# EAGLE design microzed_sd_v0.4 (EAGLE 6.5.4)
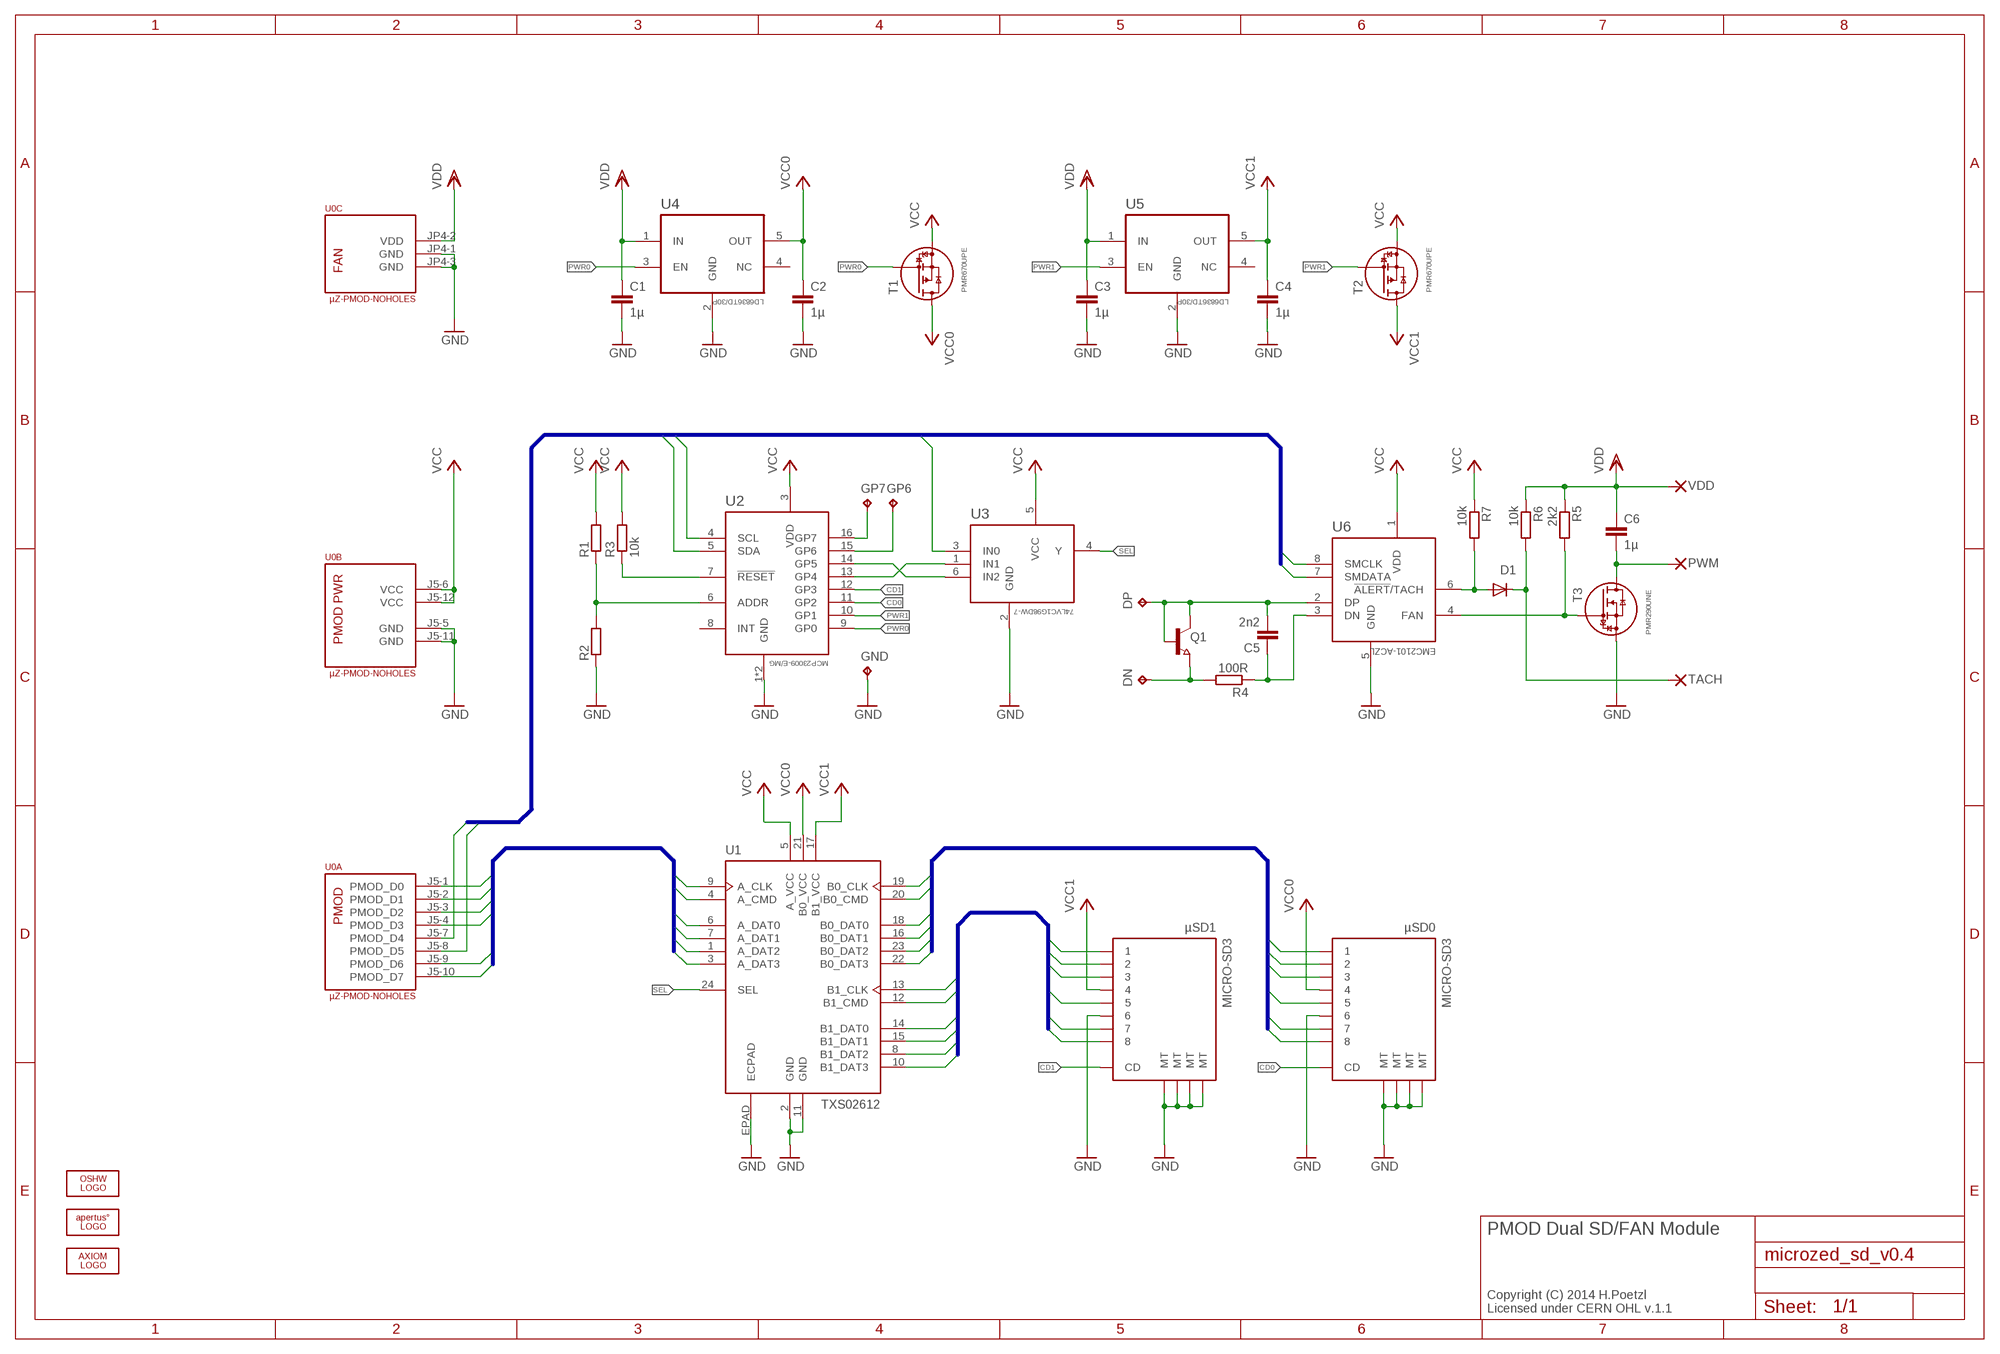
[diagram p0: schematic, sheet 1]

## Parts
C1  1µ  C-EUC0402K  [C0402K]
C2  1µ  C-EUC0402K  [C0402K]
C3  1µ  C-EUC0402K  [C0402K]
C4  1µ  C-EUC0402K  [C0402K]
C5  2n2  C-EUC0402K  [C0402K]
C6  1µ  C-EUC0402K  [C0402K]
D1  DIODE-MICROMELF-W  [MICROMELF-W]
DN  TPTP20R  [TP20R]
DP  TPTP20R  [TP20R]
GND  TPTP20R  [TP20R]
GP6  TPTP20R  [TP20R]
GP7  TPTP20R  [TP20R]
LOGO1  OSHW_LOGO_FILLX0100-NT  [OSHW_FILLX100_NOTEXT]
PWM  WIREPAD2,15/1,0  [2,15/1,0]
Q1  NPN-TRANSISTOR_SOT23  [SOT23]
R1  R-EU_R0603  [R0603]
R2  R-EU_R0603  [R0603]
R3  10k  R-EU_R0603  [R0603]
R4  100R  R-EU_R0402  [R0402]
R5  2k2  R-EU_R0402  [R0402]
R6  10k  R-EU_R0402  [R0402]
R7  10k  R-EU_R0402  [R0402]
T1  PMR670UPE  [SOT416]
T2  PMR670UPE  [SOT416]
T3  PMR290UNE  [SOT416]
TACH  WIREPAD2,15/1,0  [2,15/1,0]
U0  µZ-PMOD-NOHOLES  [µZ-TOP-NOHOLES]
U1  TXS02612  [S-PWQFN-N24]
U2  MCP23009-E/MG  [QFN50P300X300X80-17N]
U3  74LVC1G98DW-7  [SOT65P210X110-6N]
U4  LD6836TD/30P  [SOT95P275X110-5N]
U5  LD6836TD/30P  [SOT95P275X110-5N]
U6  EMC2101-ACZL  [SOP65P490X110-8N]
U$1  APERTUS_LOGO334X100  [APERTUS_LOGO_334X100]
U$13  AXIOM_LOGO525X80  [AXIOM_LOGO_525X80]
VDD  WIREPAD2,15/1,0  [2,15/1,0]
µSD0  MICRO-SD3  [TF-MICRO-SD_PP3]
µSD1  MICRO-SD3  [TF-MICRO-SD_PP3]

## Nets
A_CLK: U0.J5-4(A:PMOD_D3) U1.9(A_CLK)
A_CMD: U0.J5-3(A:PMOD_D2) U1.4(A_CMD)
A_DAT0: U0.J5-2(A:PMOD_D1) U1.6(A_DAT0)
A_DAT1: U0.J5-1(A:PMOD_D0) U1.7(A_DAT1)
A_DAT2: U0.J5-9(A:PMOD_D6) U1.1(A_DAT2)
A_DAT3: U0.J5-10(A:PMOD_D7) U1.3(A_DAT3)
B0_CLK: U1.19(B0_CLK) µSD0.5
B0_CMD: U1.20(B0_CMD) µSD0.3
B0_DAT0: U1.18(B0_DAT0) µSD0.7
B0_DAT1: U1.16(B0_DAT1) µSD0.8
B0_DAT2: U1.23(B0_DAT2) µSD0.1
B0_DAT3: U1.22(B0_DAT3) µSD0.2
B1_CLK: U1.13(B1_CLK) µSD1.5
B1_CMD: U1.12(B1_CMD) µSD1.3
B1_DAT0: U1.14(B1_DAT0) µSD1.7
B1_DAT1: U1.15(B1_DAT1) µSD1.8
B1_DAT2: U1.8(B1_DAT2) µSD1.1
B1_DAT3: U1.10(B1_DAT3) µSD1.2
CD0: U2.11(GP2) µSD0.CD
CD1: U2.12(GP3) µSD1.CD
DN: DN.TP Q1.2(E) R4.2
DP: C5.2 DP.TP Q1.1(B) Q1.3(C) U6.2(DP)
FAN: C6.2 PWM.1(P) T3.3(D)
GND: C1.2 C2.2 C3.2 C4.2 GND.TP R2.1 T3.2(S) U0.J5-5(B:GND) U0.J5-11(B:GND) U0.JP4-1(C:GND) U0.JP4-3(C:GND) U1.2(GND) U1.11(GND) U1.EPAD(ECPAD) U2.1(GND) U2.17(GND) U3.2(GND) U4.2(GND) U5.2(GND) U6.5(GND) µSD0.6 µSD0.MT1(MT) µSD0.MT2(MT) µSD0.MT3(MT) µSD0.MT4(MT) µSD1.6 µSD1.MT1(MT) µSD1.MT2(MT) µSD1.MT3(MT) µSD1.MT4(MT)
GP6: GP6.TP U2.15(GP6)
GP7: GP7.TP U2.16(GP7)
N$1: U2.13(GP4) U3.1(IN1)
N$2: U2.14(GP5) U3.6(IN2)
N$3: R1.1 R2.2 U2.6(ADDR)
N$4: R3.1 U2.7(!RESET)
N$8: C5.1 R4.1 U6.3(DN)
N$12: R5.2 T3.1(G) U6.4(FAN)
N$13: D1.A R7.2 U6.6(!ALERT!/TACH)
PWR0: T1.1(G) U2.9(GP0) U4.3(EN)
PWR1: T2.1(G) U2.10(GP1) U5.3(EN)
SCL: U0.J5-7(A:PMOD_D4) U2.4(SCL) U6.8(SMCLK)
SDA: U0.J5-8(A:PMOD_D5) U2.5(SDA) U3.3(IN0) U6.7(SMDATA)
SEL: U1.24(SEL) U3.4(Y)
TACH: D1.C R6.2 TACH.1(P)
VCC: R1.2 R3.2 R7.1 T1.2(S) T2.2(S) U0.J5-6(B:VCC) U0.J5-12(B:VCC) U1.5(A_VCC) U2.3(VDD) U3.5(VCC) U6.1(VDD)
VCC0: C2.1 T1.3(D) U1.21(B0_VCC) U4.5(OUT) µSD0.4
VCC1: C4.1 T2.3(D) U1.17(B1_VCC) U5.5(OUT) µSD1.4
VDD: C1.1 C3.1 C6.1 R5.1 R6.1 U0.JP4-2(C:VDD) U4.1(IN) U5.1(IN) VDD.1(P)
Unconnected: U2.8(INT) U4.4(NC) U5.4(NC)

## Buses
B0_CLK,B0_CMD,B0_DAT[0..3]
B1_CLK,B1_CMD,B1_DAT[0..3]
A_CLK,A_CMD,A_DAT[0..3],SEL,CD
SCL,SDA

## Notes on the sheet
- PMOD Dual SD/FAN Module
- Copyright (C) 2014 H.Poetzl
  Licensed under CERN OHL v.1.1

## Library data of the parts
C1-C6 = rcl:C-EU: CAPACITOR, European symbol
D1 = diode:DIODE-: DIODE
DN DP GND GP6 GP7 = testpad:TP: Test pad
LOGO1 = ohw-logo:OSHW_LOGO_FILL
PWM TACH VDD = wirepad:WIREPAD: Wire PAD connect wire on PCB
Q1 = semicon-smd-ipc:NPN-TRANSISTOR_: NPN TRANSISTOR
R1-R7 = rcl:R-EU_: RESISTOR, European symbol
T1 T2 = transistor:PMR670UPE: 20 V, 480 mA P-channel Trench MOSFET Herbert Poetzl
T3 = transistor:PMR290UNE: 20 V, 700 mA N-channel Trench MOSFET Herbert Poetzl
U0 = microzed:µZ-PMOD
U1 = TXS02612:TXS02612
U2 = mcp23009:MCP23009: IC, I/O EXPANDER, 8BIT, 3.4MHZ,
U3 = 74lvc1g98:74LVC1G98: CONFIGURABLE MULTIPLE-FUNCTION GATE; MPN: 74LVC1G98DW-7; OC_FARNELL: 1893843; OC_NEWARK: 47T3929; PACKAGE: SOT-6; SUPPLIER: DIODES INC.
U4 U5 = ld6836:LD6836TD/30P: LDO, 5.5V, 0.09VDO, 0.3A, 3V, 5SOT753; MPN: LD6836TD/30P; OC_FARNELL: 2308335; OC_NEWARK: 69W9605; PACKAGE: TSOP-5; SUPPLIER: NXP
U6 = emc2101:EMC2101: SMBUS FAN CONTROL WITH ACCURATE TEMPERATURE MONITORING ,MSOP-8; MPN: EMC2101-ACZL-TR; OC_FARNELL: 2361961; OC_NEWARK: 12X8574; PACKAGE: MSOP-8; SUPPLIER: MICROCHIP
U$1 = logos_apertus_axiom:APERTUS_LOGO
U$13 = logos_apertus_axiom:AXIOM_LOGO
µSD0 µSD1 = micro-sd:MICRO-SD

## Net classes
1 LVDS: width 0.305 mm, drill 0.305 mm, clearance 0.152 mm

## Board
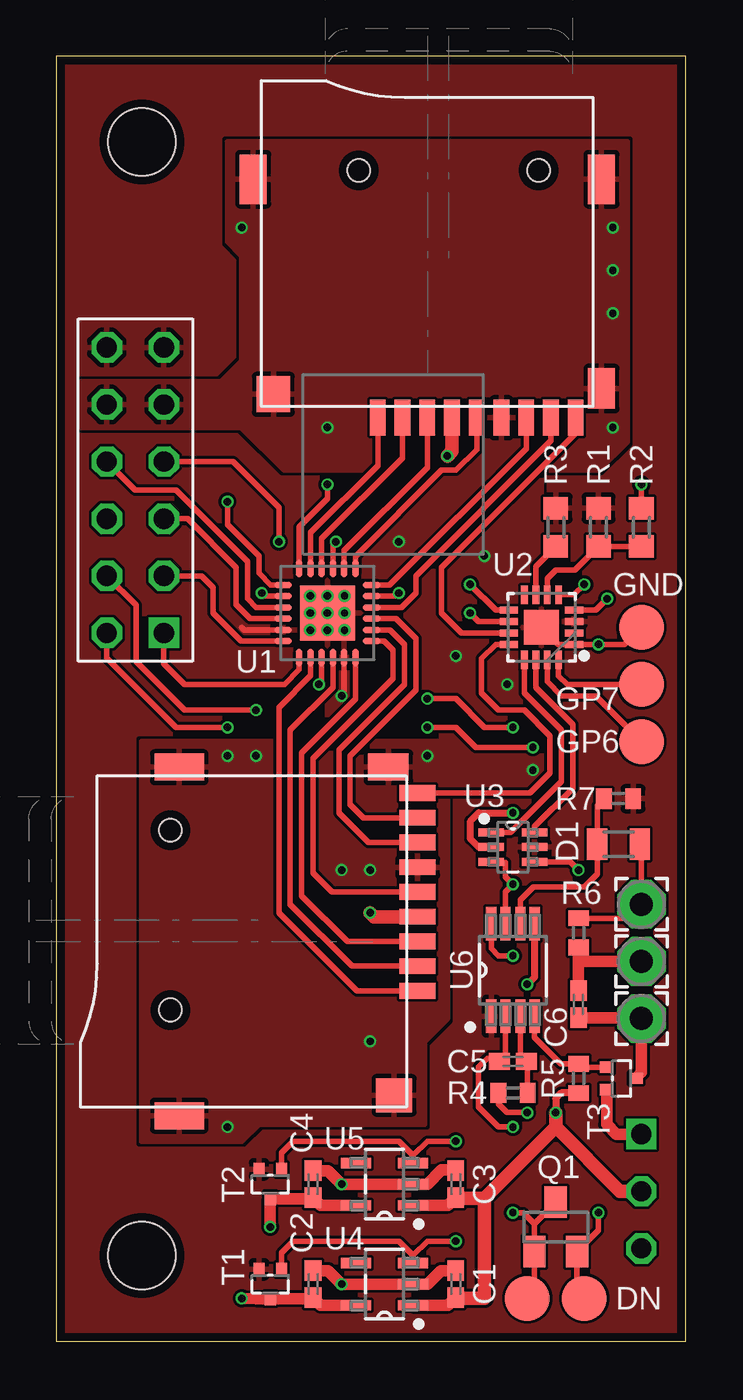
[diagram p1: board, top side]
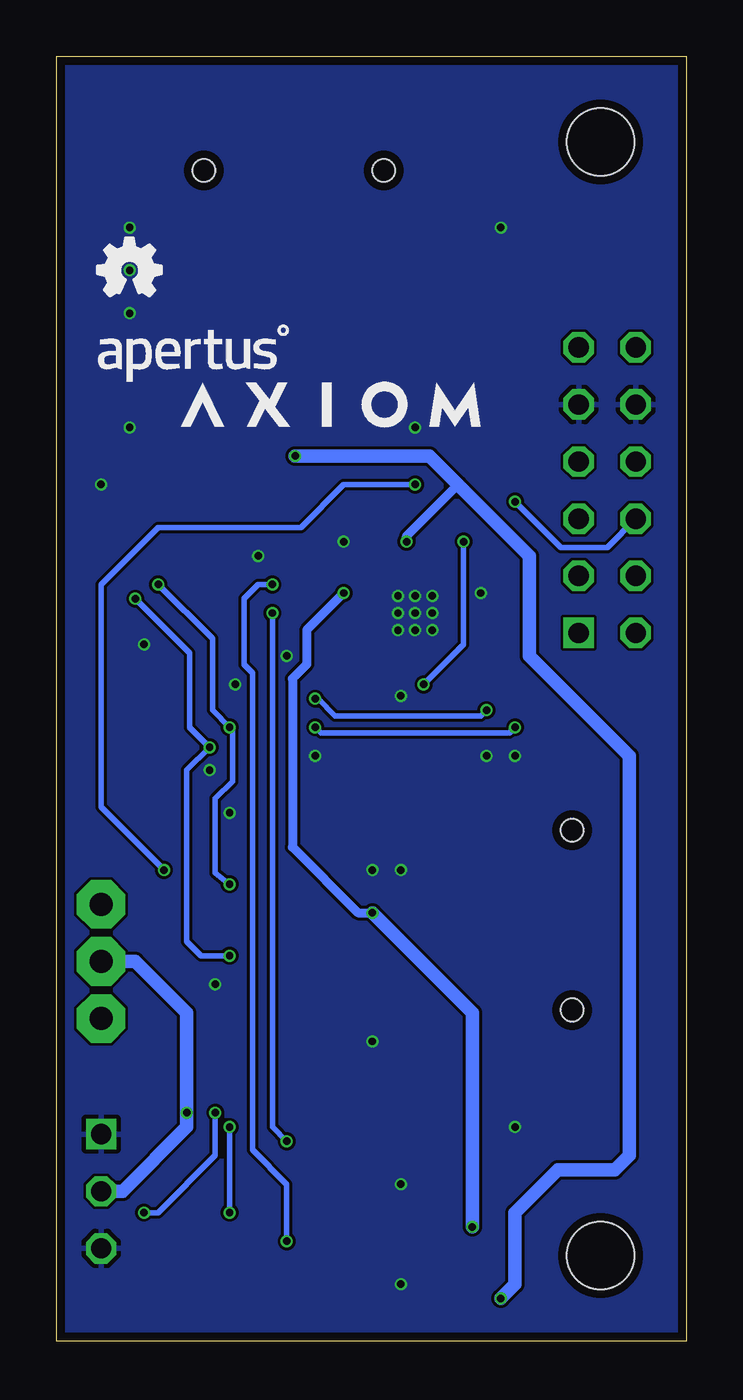
[diagram p2: board, bottom side, seen from below]

Size 28 x 57.15 mm. Coordinates in mm from the lower left corner, seen from the top.
Outline: 0,0 28,0 28,57.15 0,57.15 0,0
Copper layers (1+2*15+16): Top 0.035559375mm / dielectric 0.17018125mm / Route2 0.01778125mm / dielectric 47mil / Route15 0.0356mm / dielectric 0.2007mm / Bottom 0.0356mm
Design rules "LaenPCBOrder4L *": minimum track width 5mil, minimum drill 10mil, track to track 5mil, track to pad 5mil, pad to pad 5mil, via to via 5mil, smd to smd 5mil, copper to edge 15mil, drill to drill 5mil, minimum pad ring 4mil, minimum via ring 4mil, stop-mask expansion 4mil, vias tented up to drill 15mil, thermal gap 8mil
Holes 3 mm at 3.81,3.81 3.81,53.34
tKeepout: area 1.3,1.3 to 6.3,6.3; area 1.3,50.8 to 6.3,55.8

### Footprints (pad centres in the part's own frame; a part is rotated, then mirrored left to right if it is on the bottom)
C0402K = smd 0.925 x 0.74: 1 -0.6,0; 2 0.6,0
MICROMELF-W = smd 0.9 x 1.4: A 0.95,0; C -0.95,0
TP20R = smd 2 x 2: TP 0,0
2,15/1,0 = drill 1.016 pad 2.159 octagon: 1 0,0
SOT23 = smd 1 x 1.4: 1 -0.95,-1.1; 2 0.95,-1.1; 3 0,1.1
R0603 = smd 1 x 1.1: 1 -0.85,0; 2 0.85,0
R0402 = smd 0.7 x 0.9: 1 -0.65,0; 2 0.65,0
SOT416 = smd 0.5 x 0.6: 1 -0.5,-0.65; 2 0.5,-0.65; 3 0,0.65
µZ-TOP-NOHOLES = drill 0.9 square: J5-1 4.79,31.5; JP4-1 26.035,9.207 | drill 0.9 octagon: J5-2 4.79,34.04; J5-3 4.79,36.58; J5-4 4.79,39.12; J5-5 4.79,41.66; J5-6 4.79,44.2; J5-7 2.25,31.5; J5-8 2.25,34.04; J5-9 2.25,36.58; J5-10 2.25,39.12; J5-11 2.25,41.66; J5-12 2.25,44.2; JP4-2 26.035,6.668; JP4-3 26.035,4.128
S-PWQFN-N24 = smd 0.78 x 0.28: 1 -1.975,1.25; 2 -1.975,0.75; 3 -1.975,0.25; 4 -1.975,-0.25; 5 -1.975,-0.75; 6 -1.975,-1.25; 13 1.975,-1.25; 14 1.975,-0.75; 15 1.975,-0.25; 16 1.975,0.25; 17 1.975,0.75; 18 1.975,1.25 | smd 0.28 x 0.78: 7 -1.25,-1.975; 8 -0.75,-1.975; 9 -0.25,-1.975; 10 0.25,-1.975; 11 0.75,-1.975; 12 1.25,-1.975; 19 1.25,1.975; 20 0.75,1.975; 21 0.25,1.975; 22 -0.25,1.975; 23 -0.75,1.975; 24 -1.25,1.975 | smd 2.45 x 2.45: EPAD 0,0
QFN50P300X300X80-17N = smd 0.813 x 0.305: 1 -1.448,0.762; 2 -1.448,0.254; 3 -1.448,-0.254; 4 -1.448,-0.762; 9 1.448,-0.762; 10 1.448,-0.254; 11 1.448,0.254; 12 1.448,0.762 | smd 0.305 x 0.813: 5 -0.762,-1.448; 6 -0.254,-1.448; 7 0.254,-1.448; 8 0.762,-1.448; 13 0.762,1.448; 14 0.254,1.448; 15 -0.254,1.448; 16 -0.762,1.448 | smd 1.549 x 1.549: 17 0,0
SOT65P210X110-6N = smd 1.118 x 0.356: 1 -0.965,0.66; 2 -0.965,0; 3 -0.965,-0.66; 4 0.965,-0.66; 5 0.965,0; 6 0.965,0.66
SOT95P275X110-5N = smd 1.321 x 0.457: 1 -1.27,0.94; 2 -1.27,0; 3 -1.27,-0.94; 4 1.27,-0.94; 5 1.27,0.94
SOP65P490X110-8N = smd 1.499 x 0.457: 1 -2.057,0.965; 2 -2.057,0.33; 3 -2.057,-0.33; 4 -2.057,-0.965; 5 2.057,-0.965; 6 2.057,-0.33; 7 2.057,0.33; 8 2.057,0.965
TF-MICRO-SD_PP3 = smd 0.7 x 1.6: 1 2.2,11; 2 1.1,11; 3 0,11; 4 -1.1,11; 5 -2.2,11; 6 -3.3,11; 7 -4.4,11; 8 -5.5,11; CD -6.6,11 | smd 1.2 x 2.2: MT1 -7.75,0.4; MT2 7.75,0.4 | smd 1.2 x 1.8: MT3 -7.75,9.7 | smd 1.5 x 1.6: MT4 6.85,9.95 | hole 1: -4.95,0; 3.05,0

### Placement (x,y rotation side)
C1  17.78,2.54 90 top
C2  11.43,2.54 90 top
C3  17.78,6.99 90 top
C4  11.43,6.99 90 top
C5  20.32,12.45 180 top
C6  23.24,14.99 270 top
D1  25.02,22.1 180 top
DN  23.5,1.91 0 top
DP  20.95,1.91 0 top
GND  26.04,31.75 0 top
GP6  26.04,26.67 0 top
GP7  26.04,29.21 0 top
LOGO1  26.19,46.51 0 bottom
PWM  26.04,14.35 0 top
Q1  22.23,5.08 0 top
R1  24.13,36.2 90 top
R2  26.04,36.2 270 top
R3  22.23,36.2 90 top
R4  20.32,11.05 180 top
R5  23.24,11.68 90 top
R6  23.24,18.16 90 top
R7  25.02,24.13 180 top
T1  9.53,2.54 180 top
T2  9.53,6.99 180 top
T3  25.15,11.68 270 top
TACH  26.04,19.43 0 top
U0  0,0 0 top
U1  12.06,32.38 0 top
U2  21.59,31.75 180 top
U3  20.32,21.97 0 top
U4  14.61,2.54 180 top
U5  14.61,6.99 180 top
U6  20.32,16.51 90 top
U$1  26.16,42.67 0 bottom
U$13  22.48,40.64 0 bottom
VDD  26.04,16.89 0 top
µSD0  16.51,52.07 180 top
µSD1  5.08,17.78 270 top

### Tracks (layer width: path | path; a pad name or v marks a point on that pad's centre or on a via)
A_CLK  (via drill 0.33)
  Top 0.254: U1.9 11.81,29.34 v11.68,29.21 | U0.J5-4 7.87,39.12 9.91,37.08 v9.91,35.56
  Bottom 0.254: v9.91,35.56 9.91,30.99 v11.68,29.21
A_CMD
  Top 0.254: U0.J5-3 5.84,36.58 8,34.42 8,32.77 8.63,32.13 U1.4
A_DAT0
  Top 0.254: U0.J5-2 6.47,34.04 6.99,33.53 6.99,32.38 8.23,31.14 U1.6
A_DAT1
  Top 0.254: U1.7 10.81,29.86 10.16,29.21 5.71,29.21 4.79,30.14 U0.J5-1
A_DAT2  (via drill 0.33)
  Top 0.254: U1.1 9.54,33.63 9.02,34.16 9.02,34.92 7.62,36.32 v7.62,37.34
  Bottom 0.254: U0.J5-9 3.52,35.31 5.59,35.31 v7.62,37.34
A_DAT3
  Top 0.254: U0.J5-10 3.52,37.85 5.33,37.85 8.51,34.67 8.51,33.02 8.89,32.63 U1.3
B0_CLK
  Top 0.254: U1.19 13.31,34.91 17.14,38.73 17.78,38.73 18.71,39.66 µSD0.5
B0_CMD
  Top 0.254: µSD0.3 16.51,38.86 12.81,35.17 U1.20
B0_DAT0
  Top 0.254: U1.18 14.84,33.63 20.91,39.71 µSD0.7
B0_DAT1
  Top 0.254: U1.16 15.36,32.63 16,33.27 16,34.04 22.01,40.04 µSD0.8
B0_DAT2
  Top 0.254: µSD0.1 14.31,38.95 11.31,35.95 U1.23
B0_DAT3
  Top 0.254: µSD0.2 15.41,39.29 11.81,35.69 U1.22
B1_CLK
  Top 0.254: µSD1.5 12.28,19.98 11.43,20.83 11.43,25.91 14.99,29.46 14.99,30.73 14.59,31.14 U1.13
B1_CMD
  Top 0.254: µSD1.3 12.95,17.78 10.92,19.81 10.92,26.16 13.31,28.55 U1.12
B1_DAT0
  Top 0.254: µSD1.7 13.89,22.18 12.57,23.5 12.57,26.29 15.49,29.21 15.49,30.99 14.85,31.64 U1.14
B1_DAT1
  Top 0.254: µSD1.8 13.68,23.28 13.08,23.88 13.08,26.04 16,28.96 16,31.24 15.11,32.13 U1.15
B1_DAT2
  Top 0.254: µSD1.1 13.38,15.58 9.91,19.05 9.91,28.19 11.31,29.6 U1.8
B1_DAT3
  Top 0.254: µSD1.2 13.16,16.68 10.41,19.43 10.41,27.18 12.31,29.08 U1.10
CD0
  Top 0.254: µSD0.CD 23.11,40.38 17.14,34.42 17.14,32.38 18.03,31.5 U2.11
CD1
  Top 0.254: µSD1.CD 21.08,24.38 21.97,25.27 21.97,26.92 20.83,28.07 19.68,28.07 18.92,28.83 18.92,30.35 19.56,30.99 U2.12
DN  (via drill 0.33)
  Top 0.254: v20.95,10.16 20.97,10.18 20.05,10.18 19.67,10.56 R4.2 | v24.13,5.71 24.13,4.93 Q1.2 23.18,2.23 DN.TP
  Bottom 0.254: v20.95,10.16 20.95,8.26 23.5,5.71 v24.13,5.71
DP  (via drill 0.33)
  Top 0.254: U6.2 19.99,12.34 C5.2 19.18,12.57 18.8,12.19 18.8,10.41 19.68,9.53 v20.32,9.53 | DP.TP 21.27,2.23 Q1.1 21.27,5.23 | 21.27,5.23 Q1.3 | v20.32,5.71 20.79,5.71 21.27,5.23
  Bottom 0.254: v20.32,9.53 v20.32,5.71
FAN
  Top 0.254: 26,14.39 PWM.1 | 25.78,11.7 T3.3
  Top 0.508: C6.2 26,14.39 | PWM.1 26.04,11.95 25.78,11.7
GND  (via drill 0.33)
  Top 0.254: U1.11 12.81,28.82 v12.7,28.7 | U1.2 9.28,33.13 v9.14,33.27 | 12.94,31.51 v12.83,31.62 | R2.1 v26.04,38.1 | U2.17 22.35,30.99 U2.1 v24.13,30.99 25.27,30.99 GND.TP
  Top 0.305: U3.2 18.8,21.97 18.43,22.34 18.43,23.13 18.8,23.5 v20.32,23.5 | U6.5 21.29,16.18 v20.95,15.88
  Top 0.508: C1.2 17.11,3.14 16.51,2.54 U4.2 v12.7,2.54 12.1,3.14 C2.2 | C3.2 17.75,7.62 17.14,7.62 16.51,6.99 U5.2 v12.7,6.99 12.1,7.58 C4.2 | T3.2 24.5,9.64 24.93,9.21 U0.JP4-1
  other vias: 16.51,26.04 8.89,26.04 7.62,9.53 7.62,26.04 24.77,49.53 24.77,40.64 11.3,33.15 12.06,32.38 11.3,32.38 11.3,31.62 12.06,31.62 12.06,33.15 12.83,32.38 12.83,33.15 8.26,49.53 15.24,35.56 19.05,34.92 17.78,30.48 20.07,29.21 21.21,25.4 13.97,20.95 12.7,20.95 24.77,47.62 24.77,45.72 12.06,40.64 13.97,13.34
  pour Bottom: 0,57.15 27.94,57.15 27.94,0 0,0
  pour Top (rank 2): 3.81,26.67 17.4,26.67 17.4,14.35 16.38,13.34 16.38,9.65 9.02,9.65 8.26,8.89 3.81,8.89
  pour Top (rank 2): 25.4,53.34 25.4,40.01 24.13,38.73 10.16,38.73 8.26,40.64 1.14,40.64 1.14,42.67 7.37,42.67 8.26,43.56 8.26,48.26 7.62,48.9 7.62,53.34
  pour Top (rank 2): 21.59,38.73 21.59,24.77 17.14,24.77 17.14,27.3 12.06,27.3 12.06,38.73
GP6
  Top 0.254: U2.15 21.84,29.34 22.48,28.7 24,28.7 GP6.TP
GP7
  Top 0.254: GP7.TP 22.73,29.21 22.35,29.59 U2.16
N$1
  Top 0.254: U3.1 20.22,22.63 22.48,24.89 22.48,27.18 20.83,28.83 U2.13
N$2
  Top 0.254: U3.6 21.29,22.89 22.99,24.59 22.99,27.43 21.34,29.08 U2.14
N$3
  Top 0.254: R2.2 R1.1 23.07,34.29 22.23,34.29 21.84,33.91 U2.6
N$4
  Top 0.254: U2.7 21.34,34.46 R3.1
N$8
  Top 0.254: U6.3 20.65,12.34 C5.1 20.97,12.52 R4.1
N$12
  Top 0.254: U6.4 21.29,13.51 22.46,12.33 R5.2 23.39,12.18 T3.1
N$13
  Top 0.254: U6.6 20.65,19.63 21.22,20.21 23.5,20.21 24.07,20.78 D1.A 24.07,23.83 R7.2
PWR0  (via drill 0.33)
  Top 0.254: v17.78,4.45 16.51,4.45 15.88,3.81 | 15.88,3.81 U4.3 | T1.1 10.03,3.93 10.54,4.45 15.24,4.45 15.88,3.81 | U2.9 19.56,32.51 v18.41,33.66
  Bottom 0.254: v18.41,33.66 19.05,33.66 19.68,33.02 19.68,30.1 19.3,29.72 19.3,8.51 17.78,6.99 v17.78,4.45
PWR1  (via drill 0.33)
  Top 0.254: v17.78,8.89 16.51,8.89 15.88,8.26 | 15.88,8.26 U5.3 | T2.1 10.03,8.37 10.54,8.89 15.24,8.89 15.88,8.26 | U2.10 18.8,32 v18.41,32.38
  Bottom 0.254: v18.41,32.38 18.41,9.53 v17.78,8.89
SCL  (via drill 0.33)
  Top 0.254: U0.J5-7 2.25,30.39 5.33,27.3 v7.62,27.3 | v16.51,27.3 17.78,27.3 18.67,26.42 v21.21,26.42 | U6.8 19.36,17.48 19.68,17.14 v20.32,17.14 | v24.51,33.02 24,32.51 U2.4
  Bottom 0.254: v7.62,27.3 7.87,27.05 16.26,27.05 v16.51,27.3 | v20.32,17.14 21.59,17.14 22.23,17.78 22.23,25.4 v21.21,26.42 22.1,27.3 22.1,30.61 v24.51,33.02
SDA  (via drill 0.33)
  Top 0.254: v8.89,28.07 5.71,28.07 3.56,30.23 3.56,32.73 U0.J5-8 | v16.51,28.57 17.78,28.57 19.05,27.3 v20.32,27.3 | U6.7 19.99,19.99 v20.32,20.32 19.99,20.65 19.99,21.29 U3.3 | v23.5,33.66 23.04,33.2 U2.5
  Bottom 0.254: v8.89,28.07 9.14,27.81 15.62,27.81 16.38,28.57 v16.51,28.57 | v20.32,20.32 20.95,20.83 20.95,24.13 20.19,24.89 20.19,27.18 v20.32,27.3 21.08,28.07 21.08,31.24 v23.5,33.66
SEL  (via drill 0.33)
  Top 0.254: U1.24 10.81,36.22 12.06,37.47 v12.06,38.1 | U3.4 22.89,21.31 v23.24,20.95
  Bottom 0.254: v12.06,38.1 15.24,38.1 17.14,36.2 23.5,36.2 26.04,33.66 26.04,23.75 v23.24,20.95
TACH
  Top 0.254: R6.2 25.29,18.81 TACH.1 26.04,22.03 D1.C
VCC
  Top 0.254: U1.5 8.37,31.64 8.26,31.75
  pour Top (rank 3): 0,57.15 27.94,57.15 27.94,0 0,0
VCC0  (via drill 0.33)
  Top 0.254: v12.45,35.56 12.31,35.43 U1.21
  Top 0.508: U4.5 11.77,1.6 C2.1 11.38,1.89 T1.3 8.9,1.89 v8.26,1.91
  Top 0.61: µSD0.4 17.61,39.58 v17.4,39.37
  Bottom 0.406: v12.45,35.56 12.45,35.81 10.16,38.1
  Bottom 0.61: v17.4,39.37 11.43,39.37 10.16,38.1 6.99,34.92 6.99,30.48 2.54,26.04 2.54,8.26 3.17,7.62 5.71,7.62 7.62,5.71 7.62,2.54 v8.26,1.91
VCC1  (via drill 0.33)
  Top 0.254: U1.17 15.1,33.13 v15.24,33.27
  Top 0.508: U5.5 11.77,6.04 C4.1 11.38,6.33 T2.3 v9.53,5.08
  Top 0.61: v13.97,19.05 14.14,18.88 µSD1.4
  Bottom 0.406: v15.24,33.27 16.89,31.62 16.89,30.1 17.53,29.46 17.53,21.97 14.61,19.05 v13.97,19.05
  Bottom 0.61: v9.53,5.08 9.53,14.61 v13.97,19.05
VDD  (via drill 0.33)
  Top 0.305: R5.1 22.46,11.03 22.23,10.79 v22.23,10.16
  Top 0.508: U5.1 17.44,6.04 C3.1 | U4.1 17.44,1.6 C1.1 | C6.1 23.24,16.89 | 23.24,16.89 R6.1 | VDD.1 23.24,16.89
  Top 0.61: 22.23,9.53 19.05,6.35 | 19.05,6.35 17.82,6.35 C3.1 | 19.05,6.35 19.05,1.91 17.82,1.91 C1.1 | 22.23,9.53 v22.23,10.16 | 22.23,9.53 25.08,6.67 U0.JP4-2
  Bottom 0.61: VDD.1 24.51,16.89 22.23,14.61 v22.23,10.16 22.23,9.53 25.08,6.67 U0.JP4-2

### Text on the board
_bSilk: PMOD SD/FAN ADAPTER | Copyright (C) 2014 H.Poetzl / Licensed under CERN OHL v.1.2